# EAGLE design switch (EAGLE 9.4.2)
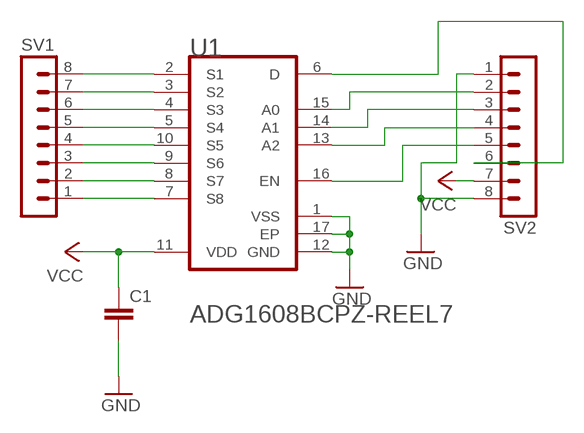
[diagram p0: schematic, sheet 1]

## Parts
C1  C-EUC0805  [C0805]
SV1  MA08-1  [MA08-1]
SV2  MA08-1  [MA08-1]
U1  ANALOG_DEVICES_ADG1608BCPZ-REEL7ANALOG_DEVICES_ADG1608BCPZ-REEL7_0_1  [ANALOG_DEVICES_ADG1608BCPZ-REEL7_1]

## Nets
GND: C1.2 SV2.1 SV2.8 U1.1(VSS) U1.12(GND) U1.17(EP)
N$1: SV2.5 U1.16(EN)
N$2: SV1.8 U1.2(S1)
N$3: SV2.6 U1.6(D)
N$4: SV2.2 U1.15(A0)
N$5: SV2.3 U1.14(A1)
N$6: SV2.4 U1.13(A2)
N$7: SV1.7 U1.3(S2)
N$8: SV1.6 U1.4(S3)
N$9: SV1.5 U1.5(S4)
N$10: SV1.4 U1.10(S5)
N$11: SV1.3 U1.9(S6)
N$12: SV1.2 U1.8(S7)
N$13: SV1.1 U1.7(S8)
VCC: C1.1 SV2.7 U1.11(VDD)

## Library data of the parts
C1 = rcl:C-EU: CAPACITOR, European symbol; SPICEPREFIX: C
SV1 SV2 = con-lstb:MA08-1: PIN HEADER; OC_FARNELL: unknown; OC_NEWARK: unknown
U1 = Analog Devices - ADG1608BCPZ-REEL7:ANALOG_DEVICES_ADG1608BCPZ-REEL7: ADI-ADG1608-CP-16-22; BANDWIDTH_HZ: 40M, 40M, 37M, 34M; CIIVA_IDS: 1260922; CODE__JEDEC: MO-220-WEED-6; COMPONENT_LINK_1_DESCRIPTION: Manufacturer URL; COMPONENT_LINK_1_URL: http://www.analog.com/en/index.html; COMPONENT_LINK_3_DESCRIPTION: Package Specification; COMPONENT_LINK_3_URL: http://www.analog.com/static/imported-files/packages/PKG_PDF/LFCSP(CP)/CP-16/CP_16_22.pdf; DATASHEET: http://www.analog.com/static/imported-files/data_sheets/ADG1608_1609.pdf; DATASHEET_VERSION: Rev. 0; FOOTPRINT_VARIANT_NAME_0: Level C; FOOTPRINT_VARIANT_NAME_1: Level B; FOOTPRINT_VARIANT_NAME_2: Level A; IMPORTED: yes; IMPORTED_FROM: vault; IMPORT_TS: 1521849604; MAX_ANALOG_SIGNAL_RANGE: 0 to Vdd; MF: Analog Devices; MOUNTING_TECHNOLOGY: Surface Mount; MPN: ADG1608BCPZ-REEL7; PACKAGE: CP-16-22; PACKAGE_DESCRIPTION: 16-Pin Lead Frame Chip Scale Package, Body 3 x 3 mm, Pitch 0.5 mm; PACKAGE_VERSION: 08-16-2010-E, 09/2011; PACKING: Reel; PREFIX: U; RELEASE_DATE: 1391088286; RON_OHMS: 4.4; T_TRANSITION_S: 150n; VAULT_GUID: 632A772B-EEA1-4CC9-B466-A6B56E82AB17; VAULT_REVISION: 0E8567BA-500B-4A80-B233-9CF9DE916128

## Board
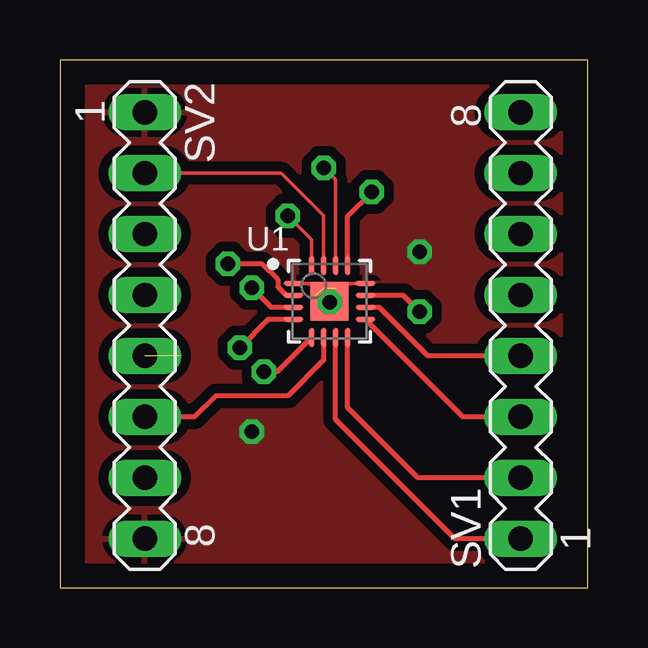
[diagram p1: board, top side]
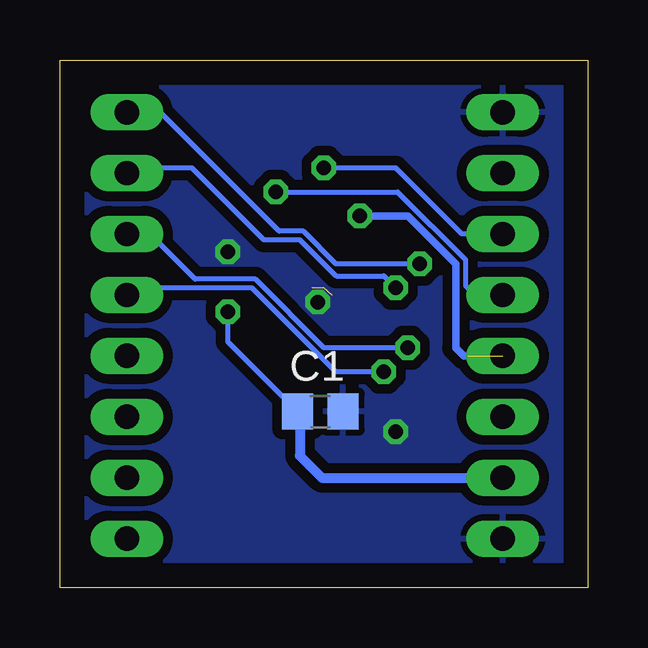
[diagram p2: board, bottom side, seen from below]

Size 22 x 22 mm. Coordinates in mm from the lower left corner, seen from the top.
Outline: 0,0 22,0 22,22 0,22 0,0
Copper layers (1*16): Top 0.035mm / dielectric 1.5mm / Bottom 0.035mm
Design rules "default": minimum track width 6mil, minimum drill 0.35mm, track to track 6mil, track to pad 6mil, pad to pad 6mil, via to via 6mil, smd to smd 6mil, copper to edge 40mil, drill to drill 6mil, minimum pad ring 10mil, minimum via ring 8mil, stop-mask expansion 4mil, vias tented up to drill 0mil, thermal gap 10mil

### Footprints (pad centres in the part's own frame; a part is rotated, then mirrored left to right if it is on the bottom)
C0805 = smd 1.3 x 1.5: 1 -0.95,0; 2 0.95,0
MA08-1 = drill 1.016 long: 1 -8.89,0; 2 -6.35,0; 3 -3.81,0; 4 -1.27,0; 5 1.27,0; 6 3.81,0; 7 6.35,0; 8 8.89,0
ANALOG_DEVICES_ADG1608BCPZ-REEL7_1 = smd 0.8 x 0.2: 1 -1.5,0.75; 2 -1.5,0.25; 3 -1.5,-0.25; 4 -1.5,-0.75; 9 1.5,-0.75; 10 1.5,-0.25; 11 1.5,0.25; 12 1.5,0.75 | smd 0.2 x 0.8: 5 -0.75,-1.5; 6 -0.25,-1.5; 7 0.25,-1.5; 8 0.75,-1.5; 13 0.75,1.5; 14 0.25,1.5; 15 -0.25,1.5; 16 -0.75,1.5 | smd 1.6 x 1.6: 17 0,0

### Placement (x,y rotation side)
C1  11.15,7.34 0 bottom
SV1  19.21,10.93 90 top
SV2  3.54,10.93 270 top
U1  11.24,11.93 0 top

### Tracks (layer width: path | path; a pad name or v marks a point on that pad's centre or on a via)
GND  (via drill 0.6)  (2 unrouted)
  Top 0.152: U1.1 10.82,12.68 11,12.5 | U1.12 11.68,12.68 11.5,12.5
  Top 0.203: 10.63,11.93 10.63,12.18
  other vias: 8,6.5 15,14 11.25,11.9
  pour Bottom (isolate 0.406): 0,22 22,22 22,0 0,0
  pour Top (isolate 0.406): 0,22 22,22 22,0 0,0
N$1  (via drill 0.6)  (1 unrouted)
  Top 0.152: 10.42,13.5 U1.16 10.49,14.51 v9.5,15.5
  Bottom 0.305: v9.5,15.5 7.5,15.5 5.5,13.5 5.5,10 5.16,9.66 5,9.66
N$2  (via drill 0.6)
  Top 0.203: v7,13.5 8.42,13.5 9.09,12.83 9.09,12.53 9.44,12.18 U1.2
  Bottom 0.203: v7,13.5 10.5,13.5 11.85,14.86 12.86,14.86 17.82,19.82 SV1.8
N$3
  Top 0.203: U1.6 10.99,9.49 9.5,8 6.5,8 5.62,7.12 SV2.6
N$4
  Top 0.152: U1.15 10.99,15.51 9.22,17.28 SV2.2
N$5  (via drill 0.6)
  Top 0.152: U1.14 11.49,17.01 v11,17.5
  Bottom 0.203: SV2.3 5.24,14.74 8,17.5 v11,17.5
N$6  (via drill 0.6)
  Top 0.152: U1.13
  Top 0.203: U1.13 11.99,15.49 v13,16.5
  Bottom 0.203: SV2.4 4.7,12.2 5.09,12.59 5.09,13.67 7.92,16.5 v13,16.5
N$7  (via drill 0.6)
  Top 0.203: U1.3 8.82,11.68 v8,12.5
  Bottom 0.203: v8,12.5 8.5,13 10.5,13 12,14.5 13.5,14.5 16.5,17.5 18.99,17.5 SV1.7
N$8  (via drill 0.6)
  Top 0.203: U1.4 8.68,11.18 v7.5,10
  Bottom 0.203: v7.5,10 11,10 13.85,12.86 16.36,12.86 18.24,14.74 SV1.6
N$9  (via drill 0.6)
  Top 0.203: U1.5 9.06,9 v8.5,9
  Bottom 0.203: v8.5,9 10.5,9 14,12.5 18.91,12.5 SV1.5
N$10
  Top 0.203: SV1.4 15.34,9.66 13.32,11.68 U1.10
N$11
  Top 0.203: SV1.3 16.8,7.12 U1.9
N$12
  Top 0.203: SV1.2 14.92,4.58 11.99,7.51 U1.8
N$13
  Top 0.203: SV1.1 16.46,2.04 11.49,7.01 U1.7
VCC  (via drill 0.6)
  Top 0.203: v15,11.5 14.32,12.18 U1.11
  Bottom 0.203: C1.1 15,10.24 v15,11.5
  Bottom 0.406: C1.1 12,7.24 12,5.5 11.08,4.58 SV2.7